# EAGLE design APCBaby8_UtilityBoard (EAGLE 8.7.0)
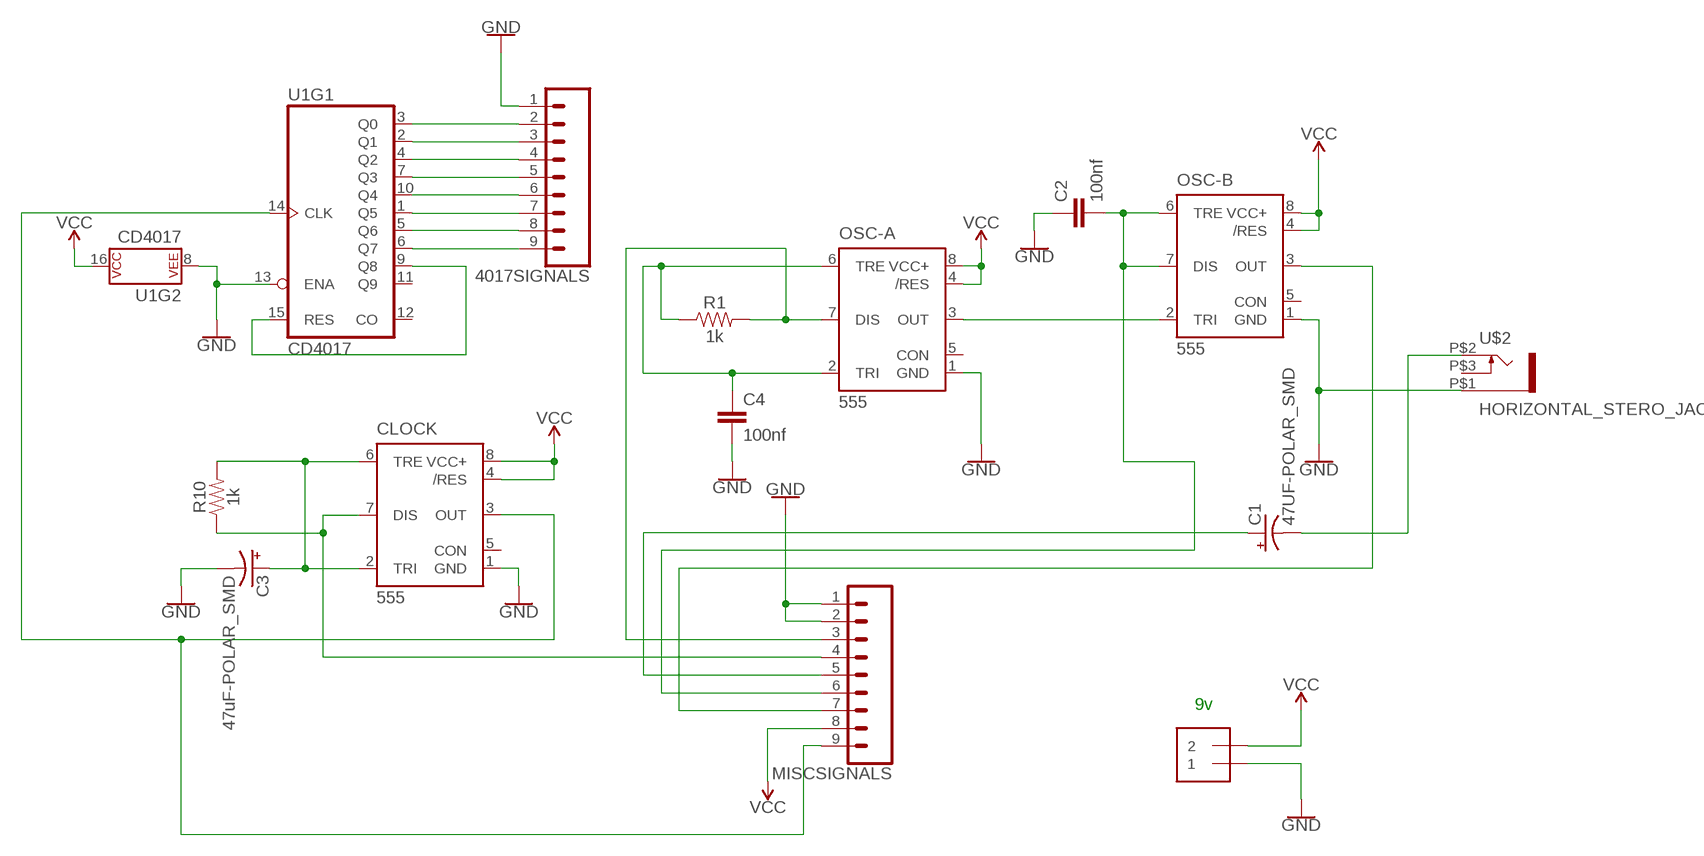
[diagram p0: schematic, sheet 1]

## Parts
9V  9v  1X2-3.5MM  [1X2-3.5MM]
4017SIGNALS  CONN_09LONGPADS  [1X09_LONGPADS]
C1  47UF-POLAR_SMD  47UF-POLAR-PANASONIC_D-50V-20%  [PANASONIC_D]
C2  100nf  0.33UF/330NF-0805-50V-10%  [0805]
C3  47uF-POLAR_SMD  47UF-POLAR-PANASONIC_D-35V-20%  [PANASONIC_D]
C4  100nf  0.33UF/330NF-0805-50V-10%  [0805]
CLOCK  555  555KIT  [DIP08-KIT]
MISCSIGNALS  CONN_09LONGPADS  [1X09_LONGPADS]
OSC-A  555  555KIT  [DIP08-KIT]
OSC-B  555  555KIT  [DIP08-KIT]
R1  1k  0.3OHM-0805-1/8W-1%  [0805]
R10  1k  0.3OHM-0805-1/8W-1%  [0805]
U1  CD4017  [DIP16]
U$2  HORIZONTAL_STERO_JACK  [HORIZONTAL_STEREO_JACK]

## Nets
CLOCK: CLOCK.3(OUT) MISCSIGNALS.9 U1.14(CLK)
GND: 9V.1 4017SIGNALS.1 C2.1 C3.- C4.2 CLOCK.1(GND) MISCSIGNALS.1 MISCSIGNALS.2 OSC-A.1(GND) OSC-B.1(GND) U1.8(P$V-) U1.13(ENA) U$2.P$1
N$1: 4017SIGNALS.2 U1.3(Q0)
N$2: 4017SIGNALS.3 U1.2(Q1)
N$3: 4017SIGNALS.4 U1.4(Q2)
N$4: 4017SIGNALS.5 U1.7(Q3)
N$5: 4017SIGNALS.6 U1.10(Q4)
N$6: 4017SIGNALS.7 U1.1(Q5)
N$7: 4017SIGNALS.8 U1.5(Q6)
N$8: 4017SIGNALS.9 U1.6(Q7)
N$14: C1.- U$2.P$2
N$28: C3.+ CLOCK.2(TRI) CLOCK.6(TRE) R10.2
N$32: C4.1 OSC-A.2(TRI) OSC-A.6(TRE) R1.1
N$34: OSC-A.3(OUT) OSC-B.2(TRI)
OUT: MISCSIGNALS.7 OSC-B.3(OUT)
PUSESIG: C2.2 MISCSIGNALS.6 OSC-B.6(TRE) OSC-B.7(DIS)
RESET: U1.9(Q8) U1.15(RES)
STEPSIG: MISCSIGNALS.3 OSC-A.7(DIS) R1.2
TEMPOSIG: CLOCK.7(DIS) MISCSIGNALS.4 R10.1
VCC: 9V.2 CLOCK.4(/RES) CLOCK.8(VCC+) MISCSIGNALS.8 OSC-A.4(/RES) OSC-A.8(VCC+) OSC-B.4(/RES) OSC-B.8(VCC+) U1.16(P$V+)
VOLSIG: C1.+ MISCSIGNALS.5
Unconnected: CLOCK.5(CON) OSC-A.5(CON) OSC-B.5(CON) U1.11(Q9) U1.12(CO) U$2.P$3

## Notes on the sheet
- 9v

## Library data of the parts
9V = adafruit:1X2: 3.5mm Terminal block http://www.ladyada.net/library/pcb/eaglelibrary.html
4017SIGNALS MISCSIGNALS = SparkFun-Connectors:CONN_09: Multi connection point. Often used as Generic Header-pin footprint for 0.1 inch spaced/style header connections On any of the 0.1 inch spaced packages, you can populate with these: Break Away Headers - Straight <https://www.sparkfun.com/products/116> (PRT-00116) Break Away Male Headers - Right Angle <https://www.sparkfun.com/products/553> (PRT-00553) Female Headers <https://www.sparkfun.com/products/115> (PRT-00115) Break Away Headers - Machine Pin <https://www.sparkfun.com/products/117> (PRT-00117) Break Away Female Headers - Swiss Machine Pin <https://www.sparkfun.com/products/743> (PRT-00743) For SCREWTERMINALS and SPRING TERMINALS visit here: Screw Terimnals on SparkFun.com <https://www.sparkfun.com/search/results?term=Screw+Terminals> (5mm/3.5mm/2.54mm spacing) This device is also useful as a general connection point to wire up your design to another part of your project. Our various solder wires solder well into these plated through hole pads. Hook-Up Wire - Assortment (Stranded, 22 AWG) <https://www.sparkfun.com/products/11375> (PRT-11375) Hook-Up Wire - Assortment (Solid Core, 22 AWG) <https://www.sparkfun.com/products/11367> (PRT-11367) View the entire wire category on our website here <https://www.sparkfun.com/categories/141> Special notes: Molex polarized connector foot print use with SKU : PRT-08231 with associated crimp pins and housings. 1MM SMD Version SKU: PRT-10208 NOTES ON THE VARIANTS LOCK and LOCK_LONGPADS... This footprint was designed to help hold the alignment of a through-hole component (i.e. 6-pin header) while soldering it into place. You may notice that each hole has been shifted either up or down by 0.005 of an inch from it's more standard position (which is a perfectly straight line). This slight alteration caused the pins (the squares in the middle) to touch the edges of the holes. Because they are alternating, it causes a "brace" to hold the component in place. 0.005 has proven to be the perfect amount of "off-center" position when using our standard breakaway headers. Although looks a little odd when you look at the bare footprint, once you have a header in there, the alteration is very hard to notice. Also,if you push a header all the way into place, it is covered up entirely on the bottom side.
C1 = SparkFun-Capacitors:47UF-POLAR: 47µF polarized capacitors A capacitor is a passive two-terminal electrical component used to store electrical energy temporarily in an electric field.
C2 C4 = SparkFun-Capacitors:0.33UF/330NF: 0.33µF/330nF ceramic capacitors A capacitor is a passive two-terminal electrical component used to store electrical energy temporarily in an electric field.; PROD_ID: CAP-08469; VALUE: 0.33µF
C3 = SparkFun-Capacitors:47UF-POLAR: 47µF polarized capacitors A capacitor is a passive two-terminal electrical component used to store electrical energy temporarily in an electric field.; PROD_ID: CAP-08478; VALUE: 47uF
CLOCK OSC-A OSC-B = SparkFun-IC-Special-Function:555: General purpose bipolar Timer Datasheet <http://www.sparkfun.com/datasheets/Components/General/ne555.pdf> SparkFun Products SparkFun SparkPunk Sequencer Kit <https://www.sparkfun.com/products/12707> (KIT-12707) Storefront Component: 555 Timer <https://www.sparkfun.com/products/9273> (COM-09273) Two parts valid for production: VFP: IC-11930 (M7555 PTH) VFP: IC-09173 (555 PTH) - Preferred; PROD_ID: IC-09173; PROD_ID_ALT: IC-11930
R1 R10 = SparkFun-Resistors:0.3OHM: 0.3Ω resistor A resistor is a passive two-terminal electrical component that implements electrical resistance as a circuit element. Resistors act to reduce current flow, and, at the same time, act to lower voltage levels within circuits. - Wikipedia; PROD_ID: RES-11622; VALUE: 0.3
U1 = SparkFun-IC-Logic:CD4017: 10-Out Decade Counter Datasheet <https://cdn.sparkfun.com/datasheets/Kits/cd4022b.pdf> SparkFun Products SparkFun SparkPunk Sequencer Kit <https://www.sparkfun.com/products/12707> (KIT-12707); PROD_ID: IC-11929
U$2 = thonkiconn:HORIZONTAL_STERO_JACK

## Board
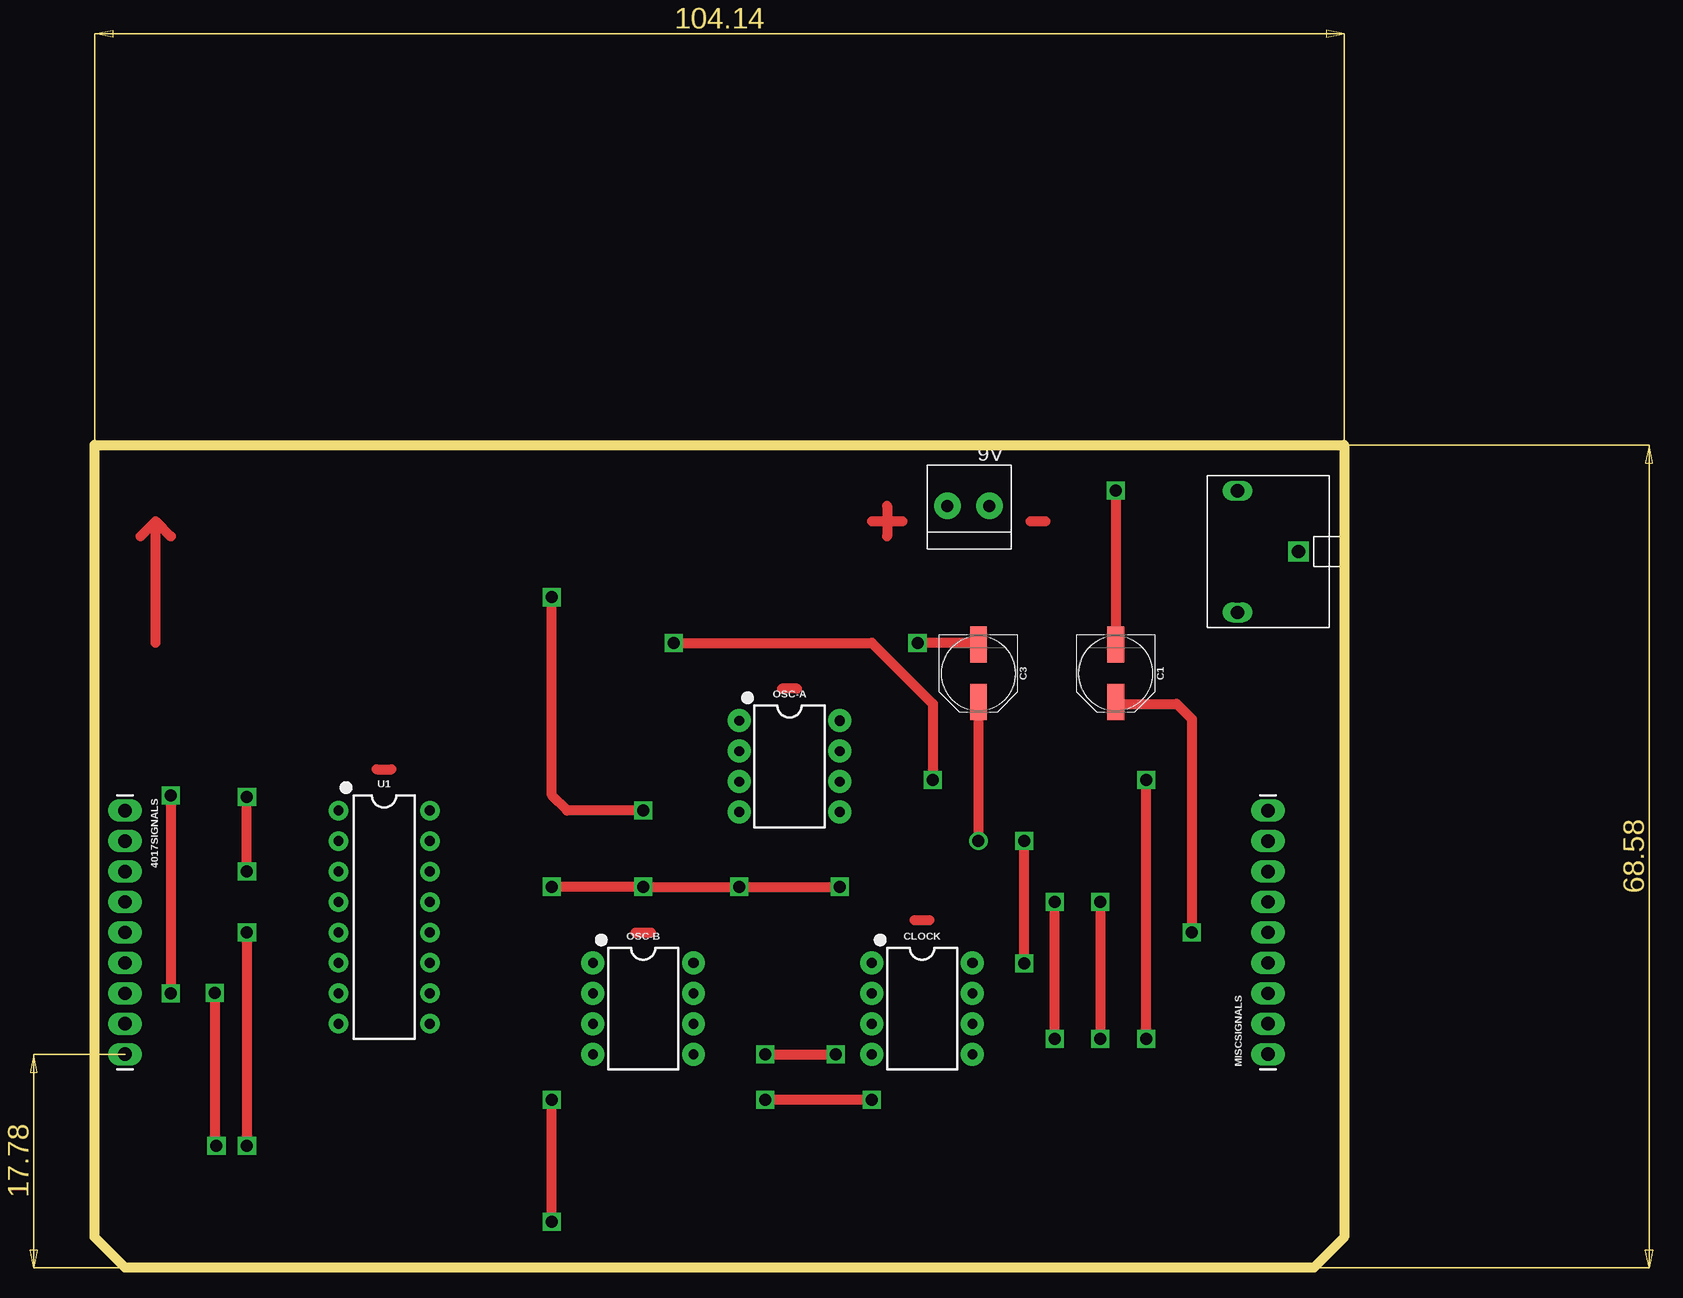
[diagram p1: board, top side]
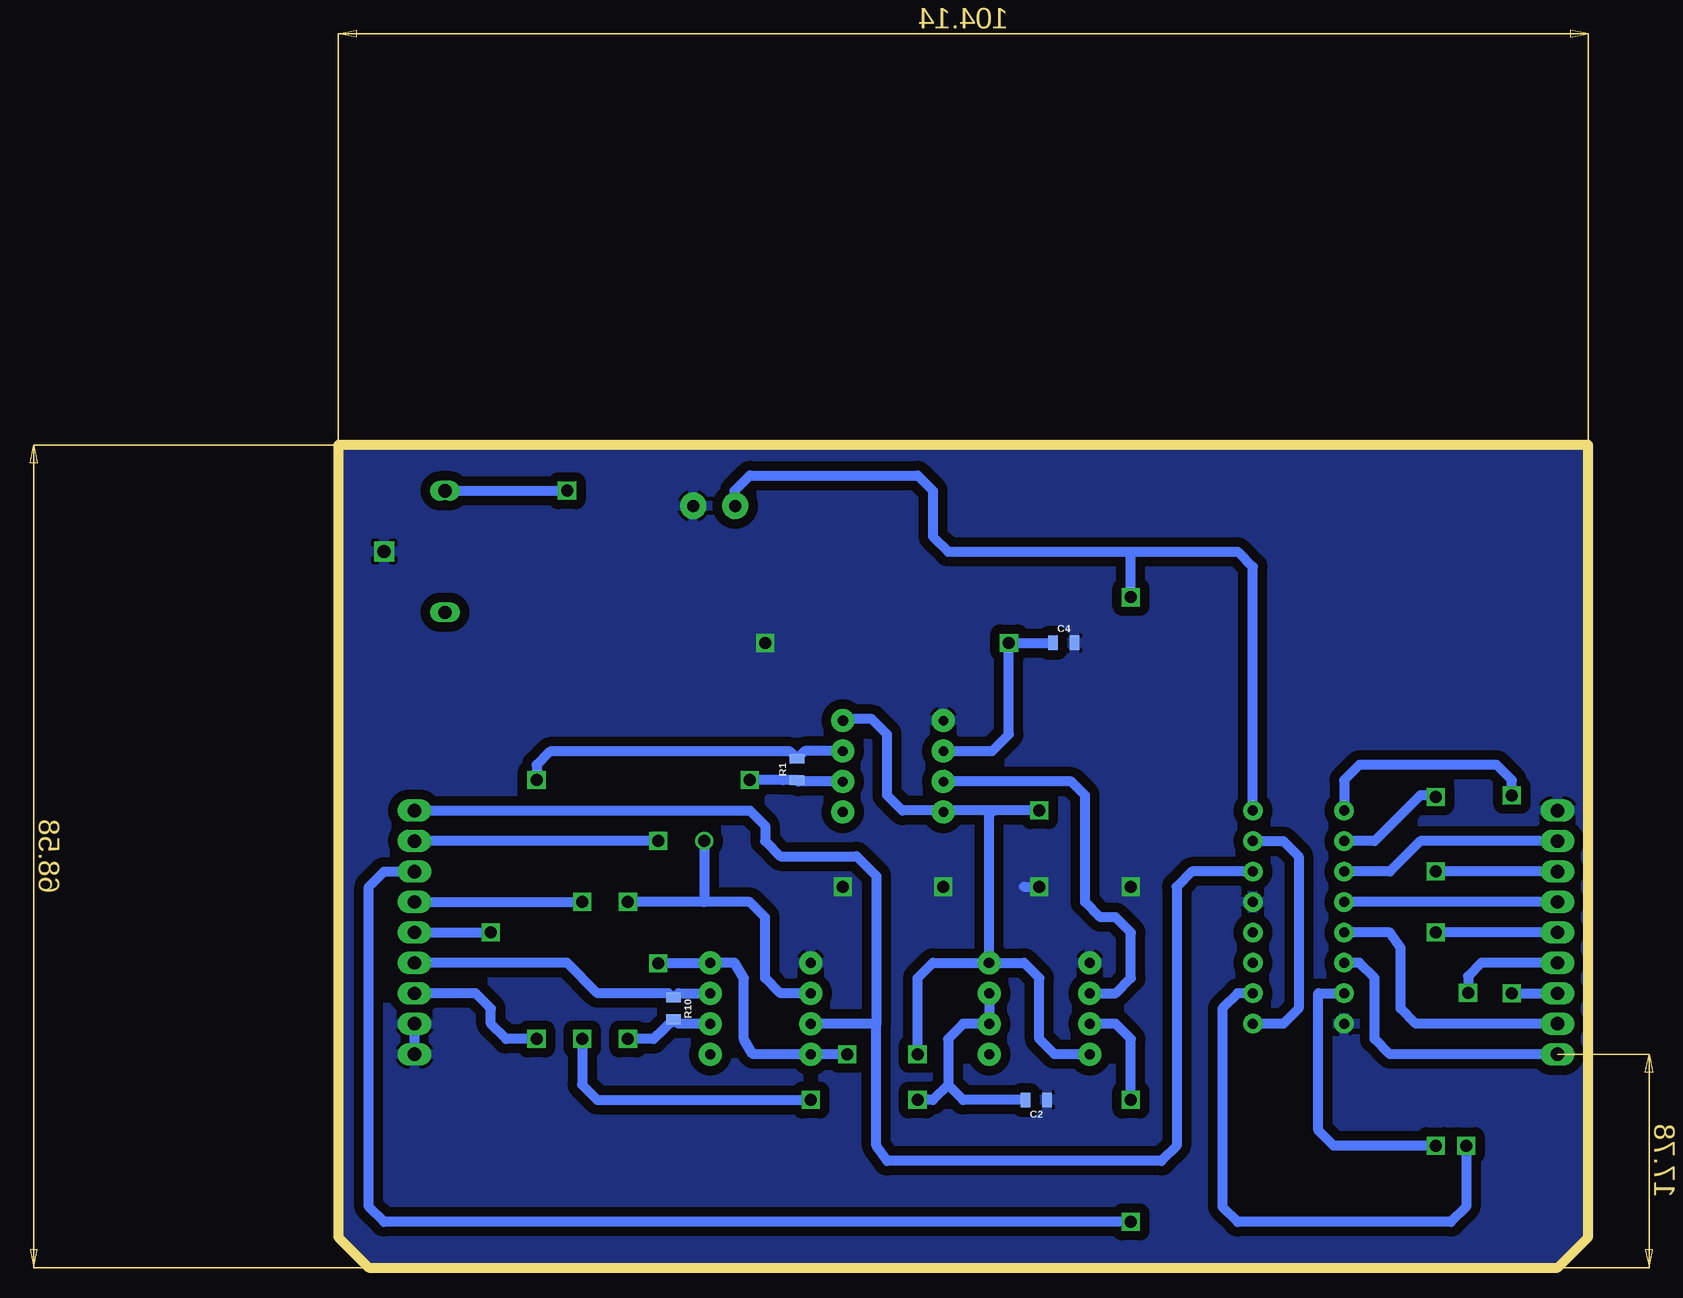
[diagram p2: board, bottom side, seen from below]

Size 104.14 x 68.58 mm. Coordinates in mm from the lower left corner, seen from the top.
Outline: 0,68.58 104.14,68.58 104.14,2.54 101.6,0 2.54,0 0,2.54 0,68.58
Copper layers (1*16): Top 0.035mm / dielectric 1.5mm / Bottom 0.035mm
Design rules "OthermillDRC_1_32_v2": minimum track width 8mil, minimum drill 0.8mm, track to track 0.794003125mm, track to pad 0.794003125mm, pad to pad 0.794003125mm, via to via 0.794003125mm, smd to smd 0mil, copper to edge 0mil, drill to drill 1mil, minimum pad ring 10mil, minimum via ring 10mil, stop-mask expansion 1mil, vias tented up to drill 30mil, thermal gap 10mil

### Footprints (pad centres in the part's own frame; a part is rotated, then mirrored left to right if it is on the bottom)
1X2-3.5MM = drill 1 pad 2.184: 1 1.8,0; 2 -1.7,0
1X09_LONGPADS = drill 1.118 pad 1.88 long: 1 0,0; 2 2.54,0; 3 5.08,0; 4 7.62,0; 5 10.16,0; 6 12.7,0; 7 15.24,0; 8 17.78,0; 9 20.32,0
PANASONIC_D = smd 3 x 1.4: + 2.4,0; - -2.4,0
0805 = smd 0.8 x 1.2: 1 -0.9,0; 2 0.9,0
DIP08-KIT = drill 0.813 pad 1.905: 1 -3.81,-4.191; 2 -1.27,-4.191; 3 1.27,-4.191; 4 3.81,-4.191; 5 3.81,4.191; 6 1.27,4.191; 7 -1.27,4.191 | drill 0.864 pad 1.905: 8 -3.81,4.191
DIP16 = drill 0.813 pad 1.626: 1 -8.89,-3.81; 2 -6.35,-3.81; 3 -3.81,-3.81; 4 -1.27,-3.81; 5 1.27,-3.81; 6 3.81,-3.81; 7 6.35,-3.81; 8 8.89,-3.81; 9 8.89,3.81; 10 6.35,3.81; 11 3.81,3.81; 12 1.27,3.81; 13 -1.27,3.81; 14 -3.81,3.81; 15 -6.35,3.81; 16 -8.89,3.81
HORIZONTAL_STEREO_JACK = drill 1.118 square: P$1 3.81,5.08 | drill 1.118 long: P$2 -1.27,10.16; P$3 -1.27,0

### Placement (x,y rotation side)
9V  72.77,63.5 0 top
4017SIGNALS  2.54,38.1 270 top
C1  85.09,49.53 270 top
C2  45.97,13.97 180 bottom
C3  73.66,49.53 270 top
C4  43.69,52.07 0 bottom
CLOCK  68.96,21.59 270 top
MISCSIGNALS  97.79,17.78 90 top
OSC-A  57.91,41.78 270 top
OSC-B  45.72,21.59 270 top
R1  65.91,41.53 90 bottom
R10  76.2,21.59 270 bottom
U1  24.13,29.21 270 top
U$2  96.52,54.61 0 top

### Tracks (layer width: path | path; a pad name or v marks a point on that pad's centre or on a via)
CLOCK
  Bottom 0.813: U1.14 33.02,33.02 34.29,31.75 34.29,10.16 35.56,8.89 58.42,8.89 59.31,10.16 59.31,20.32 | 59.31,20.32 CLOCK.3 | MISCSIGNALS.9 69.85,38.1 68.58,36.83 68.58,35.56 67.31,34.29 60.96,34.29 59.31,32.64 59.31,20.32
GND  (via drill 1)
  Top 0.813: v38.1,31.75 v45.72,31.75 v53.72,31.75 v62.1,31.75 | C3.- 73.52,52.07 v68.58,52.07
  Bottom 0.813: MISCSIGNALS.1 MISCSIGNALS.2 | 46.99,31.75 v45.72,31.75
  pour Bottom: 0,68.58 0,2.54 2.54,0 101.6,0 104.14,2.54 104.14,68.58
N$1
  Bottom 0.813: 4017SIGNALS.2 13.97,35.56 16.51,33.02 U1.3
N$2  (via drill 1)
  Top 0.813: v12.7,33.02 v12.7,39.24
  Bottom 0.813: 4017SIGNALS.3 v12.7,33.02 | v12.7,39.24 12.83,39.37 13.97,39.37 17.78,35.56 U1.2
N$3
  Bottom 0.813: 4017SIGNALS.4 U1.4
N$4  (via drill 1)
  Top 0.813: v12.7,27.94 v12.7,10.16
  Bottom 0.813: 4017SIGNALS.5 v12.7,27.94 | U1.7 22.48,22.86 22.48,11.43 21.21,10.16 v12.7,10.16
N$5  (via drill 1)
  Top 0.813: v10,22.89 10,10.32 v10.16,10.16
  Bottom 0.813: 4017SIGNALS.6 8.89,25.4 10,24.29 v10,22.89 | U1.10 29.21,22.86 30.48,21.59 30.48,5.08 29.21,3.81 11.43,3.81 10.16,5.08 v10.16,10.16
N$6  (via drill 1)
  Top 0.813: v6.35,39.37 v6.35,22.86
  Bottom 0.813: v6.35,22.86 4017SIGNALS.7 | v6.35,39.37 6.35,40.64 7.62,41.91 19.05,41.91 20.32,40.64 U1.1
N$7
  Bottom 0.813: 4017SIGNALS.8 14.35,20.32 15.62,21.59 15.62,26.67 16.51,27.94 U1.5 19.89,27.94
N$8
  Bottom 0.813: 4017SIGNALS.9 16.51,17.78 17.78,19.05 17.78,24.13 19.05,25.4 U1.6
N$10
  Top 0.813: 66.04,63.5 66.04,60.96
N$11
  Top 0.813: 64.77,62.23 67.31,62.23
N$12
  Top 0.813: 77.98,62.23 79.25,62.23
N$13
  Top 0.813: 5.08,52.07 5.08,62.23 | 5.08,62.23 6.35,60.96 | 5.08,62.23 3.81,60.96
N$14  (via drill 1)
  Top 0.813: v85.09,64.77 C1.-
  Bottom 0.813: U$2.P$2 v85.09,64.77
N$15
  Top 0.813: 23.49,41.53 24.77,41.53
N$16
  Top 0.813: 58.55,48.26 57.28,48.26
N$17
  Top 0.813: 69.6,28.96 68.33,28.96
N$18
  Top 0.813: 45.09,27.94 46.35,27.94
N$28  (via drill 1)
  Top 0.813: v80.01,19.05 v80.01,30.48 | C3.+ v73.66,35.56
  Bottom 0.813: CLOCK.6 75.78,20.32 R10.2 77.89,19.05 v80.01,19.05 | CLOCK.2 67.31,22.86 68.58,24.13 68.58,29.21 69.85,30.48 73.66,30.48 | v73.66,35.56 73.66,30.48 | 73.66,30.48 v80.01,30.48
N$32  (via drill 1)
  Top 0.813: v69.85,40.64 69.85,46.99 64.77,52.07 v48.26,52.07
  Bottom 0.813: 62.23,40.64 OSC-A.6 65.8,40.51 R1.1 67.08,40.63 67.09,40.64 v69.85,40.64 | OSC-A.2 49.66,43.05 48.26,44.45 v48.26,52.07 C4.1
N$34
  Bottom 0.813: OSC-B.2 39.37,22.86 38.1,24.13 38.1,27.94 39.37,29.21 40.64,29.21 41.91,30.48 41.91,39.37 43.05,40.51 OSC-A.3
OUT  (via drill 1)
  Top 0.813: v38.1,3.81 v38.1,13.97
  Bottom 0.813: MISCSIGNALS.7 100.33,33.02 101.6,31.75 101.6,5.08 100.33,3.81 v38.1,3.81 | v38.1,13.97 38.1,19.05 39.37,20.32 OSC-B.3
PUSESIG  (via drill 1)
  Top 0.813: v83.82,30.48 v83.82,19.05 | v64.77,13.97 v55.88,13.97
  Bottom 0.813: MISCSIGNALS.6 v83.82,30.48 | v83.82,19.05 83.82,15.24 82.55,13.97 v64.77,13.97 | OSC-B.7 OSC-B.6 52.07,20.32 53.34,19.05 53.34,15.24 | 53.34,15.24 54.61,13.97 v55.88,13.97 | 53.34,15.24 52.07,13.97 C2.2
RESET
  Bottom 0.813: U1.15 25.4,35.56 24.13,34.29 24.13,21.59 25.4,20.32 U1.9
STEPSIG  (via drill 1)
  Top 0.813: v87.63,19.05 v87.63,40.64
  Bottom 0.813: OSC-A.7 65.29,43.05 R1.2 66.5,43.01 86.53,43.01 87.63,41.91 v87.63,40.64 | v87.63,19.05 90.17,19.05 91.44,20.32 91.44,21.59 92.71,22.86 MISCSIGNALS.3
TEMPOSIG
  Bottom 0.813: CLOCK.7 75.78,22.86 R10.1 76.62,22.86 82.55,22.86 85.09,25.4 MISCSIGNALS.4
VCC  (via drill 1)
  Top 0.813: v55.88,17.78 v61.75,17.78 | v77.47,25.37 v77.47,35.56 | v45.72,38.1 39.37,38.1 38.1,39.37 v38.1,55.88
  Bottom 0.813: OSC-B.4 44.45,17.78 45.72,19.05 45.72,24.13 46.99,25.4 OSC-B.8 | OSC-A.8 61.98,45.72 59.69,45.72 58.42,44.45 58.42,39.37 57.15,38.1 53.85,38.1 OSC-A.4 53.59,38.1 49.53,38.1 | v61.75,17.78 CLOCK.4 69.6,17.78 70.36,19.05 70.36,24.13 71.12,25.4 CLOCK.8 77.44,25.4 v77.47,25.37 | v45.72,38.1 49.53,38.1 | v77.47,35.56 MISCSIGNALS.8 | v55.88,17.78 55.88,24.13 54.61,25.4 OSC-B.8 | OSC-B.8 49.53,25.78 | U1.16 27.94,58.42 29.21,59.69 38.1,59.69 | 38.1,59.69 53.34,59.69 54.61,60.96 54.61,64.77 55.88,66.04 69.85,66.04 71.12,64.77 71.12,63.55 9V.2 | OSC-B.8 49.91,37.72 49.53,38.1 | v38.1,55.88 38.1,59.69
VOLSIG  (via drill 1)
  Top 0.813: C1.+ 85.23,46.99 90.17,46.99 91.44,45.72 v91.44,27.94
  Bottom 0.813: MISCSIGNALS.5 v91.44,27.94